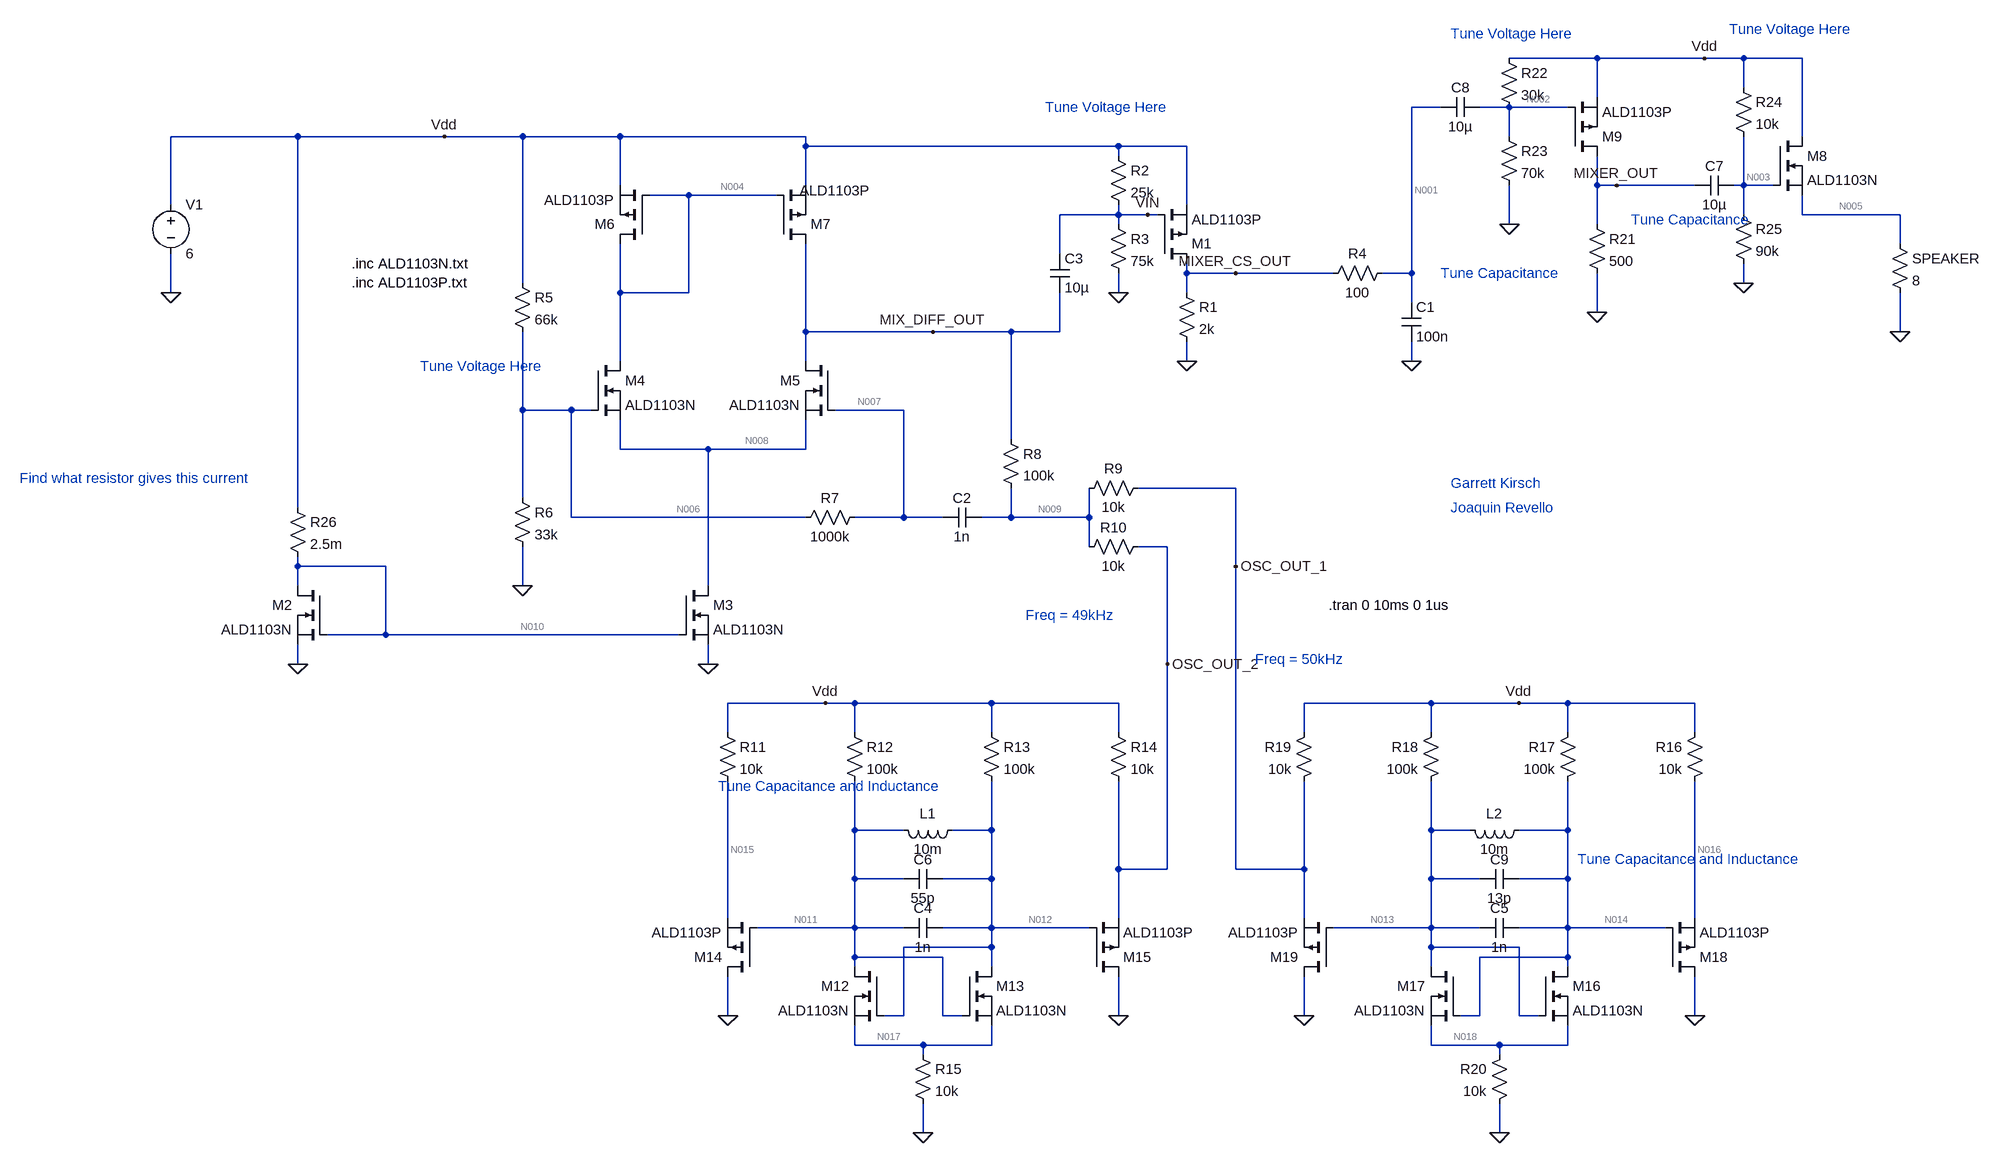
[diagram p0: schematic Final Project.asc]
Final Project.asc, the LTspice schematic file:
Version 4.1
SHEET 1 2488 1316
WIRE 1584 -464 1440 -464
WIRE 1760 -464 1584 -464
WIRE 1824 -464 1760 -464
WIRE 1920 -464 1824 -464
WIRE 1824 -416 1824 -464
WIRE 1584 -400 1584 -464
WIRE 1328 -384 1280 -384
WIRE 1440 -384 1392 -384
WIRE 1536 -384 1440 -384
WIRE -544 -336 -752 -336
WIRE -304 -336 -544 -336
WIRE -176 -336 -304 -336
WIRE -16 -336 -176 -336
WIRE 288 -336 -16 -336
WIRE 1440 -336 1440 -384
WIRE 1920 -336 1920 -464
WIRE 288 -320 288 -336
WIRE 800 -320 288 -320
WIRE 912 -320 800 -320
WIRE 800 -304 800 -320
WIRE -16 -256 -16 -336
WIRE 288 -256 288 -320
WIRE 1584 -256 1584 -304
WIRE 1616 -256 1584 -256
WIRE 1744 -256 1616 -256
WIRE 1824 -256 1824 -336
WIRE 1824 -256 1808 -256
WIRE 1872 -256 1824 -256
WIRE 96 -240 32 -240
WIRE 240 -240 96 -240
WIRE -752 -224 -752 -336
WIRE 912 -224 912 -320
WIRE 800 -208 800 -224
WIRE 800 -208 704 -208
WIRE 848 -208 800 -208
WIRE 864 -208 848 -208
WIRE 1824 -208 1824 -256
WIRE 1920 -208 1920 -240
WIRE 2080 -208 1920 -208
WIRE 800 -192 800 -208
WIRE 1440 -192 1440 -256
WIRE 1584 -192 1584 -256
WIRE 2080 -160 2080 -208
WIRE 704 -144 704 -208
WIRE 912 -112 912 -128
WIRE 992 -112 912 -112
WIRE 1152 -112 992 -112
WIRE 1280 -112 1280 -384
WIRE 1280 -112 1232 -112
WIRE -176 -96 -176 -336
WIRE 1824 -96 1824 -128
WIRE -752 -80 -752 -144
WIRE -16 -80 -16 -160
WIRE 96 -80 96 -240
WIRE 96 -80 -16 -80
WIRE 800 -80 800 -112
WIRE 912 -80 912 -112
WIRE 1280 -64 1280 -112
WIRE 1584 -48 1584 -112
WIRE 288 -16 288 -160
WIRE 496 -16 288 -16
WIRE 624 -16 496 -16
WIRE 704 -16 704 -80
WIRE 704 -16 624 -16
WIRE 2080 -16 2080 -80
WIRE -16 32 -16 -80
WIRE 288 32 288 -16
WIRE 912 32 912 0
WIRE 1280 32 1280 0
WIRE -176 112 -176 -16
WIRE -96 112 -176 112
WIRE -64 112 -96 112
WIRE 448 112 336 112
WIRE 624 160 624 -16
WIRE -16 176 -16 128
WIRE 128 176 -16 176
WIRE 288 176 288 128
WIRE 288 176 128 176
WIRE 992 240 832 240
WIRE -176 256 -176 112
WIRE -544 272 -544 -336
WIRE -96 288 -96 112
WIRE 288 288 -96 288
WIRE 448 288 448 112
WIRE 448 288 368 288
WIRE 512 288 448 288
WIRE 624 288 624 240
WIRE 624 288 576 288
WIRE 752 288 752 240
WIRE 752 288 624 288
WIRE 752 336 752 288
WIRE 880 336 832 336
WIRE -544 368 -544 352
WIRE -400 368 -544 368
WIRE 992 368 992 240
WIRE -544 400 -544 368
WIRE -176 400 -176 336
WIRE 128 400 128 176
WIRE -400 480 -400 368
WIRE -400 480 -496 480
WIRE 80 480 -400 480
WIRE -544 528 -544 496
WIRE 128 528 128 496
WIRE 880 528 880 336
WIRE 320 592 160 592
WIRE 368 592 320 592
WIRE 592 592 368 592
WIRE 800 592 592 592
WIRE 1312 592 1104 592
WIRE 1456 592 1312 592
WIRE 1536 592 1456 592
WIRE 1744 592 1536 592
WIRE 160 640 160 592
WIRE 368 640 368 592
WIRE 592 640 592 592
WIRE 800 640 800 592
WIRE 1104 640 1104 592
WIRE 1312 640 1312 592
WIRE 1536 640 1536 592
WIRE 1744 640 1744 592
WIRE 368 800 368 720
WIRE 448 800 368 800
WIRE 592 800 592 720
WIRE 592 800 528 800
WIRE 1312 800 1312 720
WIRE 1376 800 1312 800
WIRE 1536 800 1536 720
WIRE 1536 800 1456 800
WIRE 800 864 800 720
WIRE 880 864 880 528
WIRE 880 864 800 864
WIRE 992 864 992 368
WIRE 1104 864 1104 720
WIRE 1104 864 992 864
WIRE 368 880 368 800
WIRE 448 880 368 880
WIRE 592 880 592 800
WIRE 592 880 512 880
WIRE 1312 880 1312 800
WIRE 1392 880 1312 880
WIRE 1536 880 1536 800
WIRE 1536 880 1456 880
WIRE 160 944 160 720
WIRE 800 944 800 864
WIRE 1104 944 1104 864
WIRE 1744 944 1744 720
WIRE 368 960 368 880
WIRE 368 960 208 960
WIRE 448 960 368 960
WIRE 592 960 592 880
WIRE 592 960 512 960
WIRE 752 960 592 960
WIRE 1312 960 1312 880
WIRE 1312 960 1152 960
WIRE 1392 960 1312 960
WIRE 1536 960 1536 880
WIRE 1536 960 1456 960
WIRE 1696 960 1536 960
WIRE 592 992 592 960
WIRE 592 992 448 992
WIRE 1312 992 1312 960
WIRE 1456 992 1312 992
WIRE 368 1008 368 960
WIRE 512 1008 368 1008
WIRE 1536 1008 1536 960
WIRE 1536 1008 1392 1008
WIRE 368 1024 368 1008
WIRE 592 1024 592 992
WIRE 1312 1024 1312 992
WIRE 1536 1024 1536 1008
WIRE 160 1104 160 1040
WIRE 448 1104 448 992
WIRE 448 1104 416 1104
WIRE 512 1104 512 1008
WIRE 544 1104 512 1104
WIRE 800 1104 800 1040
WIRE 1104 1104 1104 1040
WIRE 1392 1104 1392 1008
WIRE 1392 1104 1360 1104
WIRE 1456 1104 1456 992
WIRE 1488 1104 1456 1104
WIRE 1744 1104 1744 1040
WIRE 368 1152 368 1120
WIRE 480 1152 368 1152
WIRE 592 1152 592 1120
WIRE 592 1152 480 1152
WIRE 1312 1152 1312 1120
WIRE 1424 1152 1312 1152
WIRE 1536 1152 1536 1120
WIRE 1536 1152 1424 1152
WIRE 480 1168 480 1152
WIRE 1424 1168 1424 1152
WIRE 480 1296 480 1248
WIRE 1424 1296 1424 1248
FLAG 912 32 0
FLAG 800 -80 0
FLAG 848 -208 VIN
FLAG -544 528 0
FLAG 128 528 0
FLAG -752 -80 0
FLAG -176 400 0
FLAG 496 -16 MIX_DIFF_OUT
FLAG 160 1104 0
FLAG 800 1104 0
FLAG 480 1296 0
FLAG 1744 1104 0
FLAG 1104 1104 0
FLAG 1424 1296 0
FLAG -304 -336 Vdd
FLAG 1760 -464 Vdd
FLAG 320 592 Vdd
FLAG 1456 592 Vdd
FLAG 880 528 OSC_OUT_2
FLAG 1584 -48 0
FLAG 1616 -256 MIXER_OUT
FLAG 1440 -192 0
FLAG 1824 -96 0
FLAG 2080 -16 0
FLAG 992 -112 MIXER_CS_OUT
FLAG 1280 32 0
FLAG 992 368 OSC_OUT_1
SYMBOL pmos 864 -128 M180
SYMATTR InstName M1
SYMATTR Value ALD1103P
SYMBOL res 896 -96 R0
SYMATTR InstName R1
SYMATTR Value 2k
SYMBOL res 784 -320 R0
SYMATTR InstName R2
SYMATTR Value 25k
SYMBOL res 784 -208 R0
SYMATTR InstName R3
SYMATTR Value 75k
SYMBOL cap 1264 -64 R0
SYMATTR InstName C1
SYMATTR Value 100n
SYMBOL nmos -496 400 M0
SYMATTR InstName M2
SYMATTR Value ALD1103N
SYMBOL nmos 80 400 R0
SYMATTR InstName M3
SYMATTR Value ALD1103N
SYMBOL nmos -64 32 R0
SYMATTR InstName M4
SYMATTR Value ALD1103N
SYMBOL nmos 336 32 M0
SYMATTR InstName M5
SYMATTR Value ALD1103N
SYMBOL pmos 32 -160 R180
SYMATTR InstName M6
SYMATTR Value ALD1103P
SYMBOL pmos 240 -160 M180
WINDOW 3 38 87 Left 2
SYMATTR Value ALD1103P
SYMATTR InstName M7
SYMBOL voltage -752 -240 R0
WINDOW 123 0 0 Left 0
WINDOW 39 0 0 Left 0
SYMATTR InstName V1
SYMATTR Value 6
SYMBOL res -192 -112 R0
SYMATTR InstName R5
SYMATTR Value 66k
SYMBOL res -192 240 R0
SYMATTR InstName R6
SYMATTR Value 33k
SYMBOL res 384 272 R90
WINDOW 0 0 56 VBottom 2
WINDOW 3 32 56 VTop 2
SYMATTR InstName R7
SYMATTR Value 1000k
SYMBOL cap 576 272 R90
WINDOW 0 0 32 VBottom 2
WINDOW 3 32 32 VTop 2
SYMATTR InstName C2
SYMATTR Value 1n
SYMBOL res 608 144 R0
SYMATTR InstName R8
SYMATTR Value 100k
SYMBOL res 848 224 R90
WINDOW 0 0 56 VBottom 2
WINDOW 3 32 56 VTop 2
SYMATTR InstName R9
SYMATTR Value 10k
SYMBOL res 848 320 R90
WINDOW 0 0 56 VBottom 2
WINDOW 3 32 56 VTop 2
SYMATTR InstName R10
SYMATTR Value 10k
SYMBOL cap 688 -144 R0
SYMATTR InstName C3
SYMATTR Value 10µ
SYMBOL nmos 1872 -336 R0
SYMATTR InstName M8
SYMATTR Value ALD1103N
SYMBOL res 144 624 R0
SYMATTR InstName R11
SYMATTR Value 10k
SYMBOL res 352 624 R0
SYMATTR InstName R12
SYMATTR Value 100k
SYMBOL res 576 624 R0
SYMATTR InstName R13
SYMATTR Value 100k
SYMBOL res 784 624 R0
SYMATTR InstName R14
SYMATTR Value 10k
SYMBOL ind 544 784 R90
WINDOW 0 5 56 VBottom 2
WINDOW 3 32 56 VTop 2
SYMATTR InstName L1
SYMATTR Value 10m
SYMBOL cap 512 944 R90
WINDOW 0 0 32 VBottom 2
WINDOW 3 32 32 VTop 2
SYMATTR InstName C4
SYMATTR Value 1n
SYMBOL nmos 416 1024 M0
SYMATTR InstName M12
SYMATTR Value ALD1103N
SYMBOL nmos 544 1024 R0
SYMATTR InstName M13
SYMATTR Value ALD1103N
SYMBOL pmos 208 1040 R180
SYMATTR InstName M14
SYMATTR Value ALD1103P
SYMBOL pmos 752 1040 M180
SYMATTR InstName M15
SYMATTR Value ALD1103P
SYMBOL res 464 1152 R0
SYMATTR InstName R15
SYMATTR Value 10k
SYMBOL res 1760 624 M0
SYMATTR InstName R16
SYMATTR Value 10k
SYMBOL res 1552 624 M0
SYMATTR InstName R17
SYMATTR Value 100k
SYMBOL res 1328 624 M0
SYMATTR InstName R18
SYMATTR Value 100k
SYMBOL res 1120 624 M0
SYMATTR InstName R19
SYMATTR Value 10k
SYMBOL ind 1360 784 M90
WINDOW 0 5 56 VBottom 2
WINDOW 3 32 56 VTop 2
SYMATTR InstName L2
SYMATTR Value 10m
SYMBOL cap 1392 944 M90
WINDOW 0 0 32 VBottom 2
WINDOW 3 32 32 VTop 2
SYMATTR InstName C5
SYMATTR Value 1n
SYMBOL nmos 1488 1024 R0
SYMATTR InstName M16
SYMATTR Value ALD1103N
SYMBOL nmos 1360 1024 M0
SYMATTR InstName M17
SYMATTR Value ALD1103N
SYMBOL pmos 1696 1040 M180
SYMATTR InstName M18
SYMATTR Value ALD1103P
SYMBOL pmos 1152 1040 R180
SYMATTR InstName M19
SYMATTR Value ALD1103P
SYMBOL res 1440 1152 M0
SYMATTR InstName R20
SYMATTR Value 10k
SYMBOL pmos 1536 -304 M180
SYMATTR InstName M9
SYMATTR Value ALD1103P
SYMBOL res 1568 -208 R0
SYMATTR InstName R21
SYMATTR Value 500
SYMBOL res 1424 -480 R0
SYMATTR InstName R22
SYMATTR Value 30k
SYMBOL res 1424 -352 R0
SYMATTR InstName R23
SYMATTR Value 70k
SYMBOL cap 1808 -272 R90
WINDOW 0 0 32 VBottom 2
WINDOW 3 32 32 VTop 2
SYMATTR InstName C7
SYMATTR Value 10µ
SYMBOL cap 1392 -400 R90
WINDOW 0 0 32 VBottom 2
WINDOW 3 32 32 VTop 2
SYMATTR InstName C8
SYMATTR Value 10µ
SYMBOL res 1808 -432 R0
SYMATTR InstName R24
SYMATTR Value 10k
SYMBOL res 1808 -224 R0
SYMATTR InstName R25
SYMATTR Value 90k
SYMBOL res 2064 -176 R0
SYMATTR InstName SPEAKER
SYMATTR Value 8
SYMBOL res 1248 -128 R90
WINDOW 0 0 56 VBottom 2
WINDOW 3 32 56 VTop 2
SYMATTR InstName R4
SYMATTR Value 100
SYMBOL cap 512 864 R90
WINDOW 0 0 32 VBottom 2
WINDOW 3 32 32 VTop 2
SYMATTR InstName C6
SYMATTR Value 55p
SYMBOL cap 1456 864 R90
WINDOW 0 0 32 VBottom 2
WINDOW 3 32 32 VTop 2
SYMATTR InstName C9
SYMATTR Value 13p
SYMBOL res -560 256 R0
SYMATTR InstName R26
SYMATTR Value 2.5m
TEXT -456 -128 Left 2 !.inc ALD1103N.txt\n.inc ALD1103P.txt
TEXT -1000 224 Left 2 ;Find what resistor gives this current
TEXT 1344 -504 Left 2 ;Tune Voltage Here
TEXT 680 -384 Left 2 ;Tune Voltage Here
TEXT -344 40 Left 2 ;Tune Voltage Here
TEXT 1328 -112 Left 2 ;Tune Capacitance
TEXT 144 728 Left 2 ;Tune Capacitance and Inductance
TEXT 1552 848 Left 2 ;Tune Capacitance and Inductance
TEXT 1344 232 Left 2 ;Garrett Kirsch
TEXT 1344 272 Left 2 ;Joaquin Revello
TEXT 1800 -512 Left 2 ;Tune Voltage Here
TEXT 1640 -200 Left 2 ;Tune Capacitance
TEXT 1144 432 Left 2 !.tran 0 10ms 0 1us
TEXT 648 448 Left 2 ;Freq = 49kHz
TEXT 1024 520 Left 2 ;Freq = 50kHz

The netlist it stands for:
* Final Project.asc
M1 MIXER_CS_OUT VIN Vdd Vdd ALD1103P
R1 MIXER_CS_OUT 0 2k
R2 Vdd VIN 25k
R3 VIN 0 75k
C1 N001 0 100n
M2 N010 N010 0 0 ALD1103N
M3 N008 N010 0 0 ALD1103N
M4 N004 N006 N008 N008 ALD1103N
M5 MIX_DIFF_OUT N007 N008 N008 ALD1103N
M6 N004 N004 Vdd Vdd ALD1103P
M7 MIX_DIFF_OUT N004 Vdd Vdd ALD1103P
V1 Vdd 0 6
R5 Vdd N006 66k
R6 N006 0 33k
R7 N007 N006 1000k
C2 N009 N007 1n
R8 MIX_DIFF_OUT N009 100k
R9 OSC_OUT_1 N009 10k
R10 OSC_OUT_2 N009 10k
C3 VIN MIX_DIFF_OUT 10µ
M8 Vdd N003 N005 N005 ALD1103N
R11 Vdd N015 10k
R12 Vdd N011 100k
R13 Vdd N012 100k
R14 Vdd OSC_OUT_2 10k
L1 N012 N011 10m
C4 N012 N011 1n
M12 N011 N012 N017 N017 ALD1103N
M13 N012 N011 N017 N017 ALD1103N
M14 0 N011 N015 N015 ALD1103P
M15 0 N012 OSC_OUT_2 OSC_OUT_2 ALD1103P
R15 N017 0 10k
R16 Vdd N016 10k
R17 Vdd N014 100k
R18 Vdd N013 100k
R19 Vdd OSC_OUT_1 10k
L2 N013 N014 10m
C5 N013 N014 1n
M16 N014 N013 N018 N018 ALD1103N
M17 N013 N014 N018 N018 ALD1103N
M18 0 N014 N016 N016 ALD1103P
M19 0 N013 OSC_OUT_1 OSC_OUT_1 ALD1103P
R20 N018 0 10k
M9 MIXER_OUT N002 Vdd Vdd ALD1103P
R21 MIXER_OUT 0 500
R22 Vdd N002 30k
R23 N002 0 70k
C7 N003 MIXER_OUT 10µ
C8 N002 N001 10µ
R24 Vdd N003 10k
R25 N003 0 90k
R§SPEAKER N005 0 8
R4 N001 MIXER_CS_OUT 100
C6 N012 N011 55p
C9 N014 N013 13p
R26 Vdd N010 2.5m
.model NMOS NMOS
.model PMOS PMOS
.lib standard.mos
.inc ALD1103N.txt
.inc ALD1103P.txt
* Find what resistor gives this current
* Tune Voltage Here
* Tune Voltage Here
* Tune Voltage Here
* Tune Capacitance
* Tune Capacitance and Inductance
* Tune Capacitance and Inductance
* Garrett Kirsch
* Joaquin Revello
* Tune Voltage Here
* Tune Capacitance
.tran 0 10ms 0 1us
* Freq = 49kHz
* Freq = 50kHz
.backanno
.end

* Results of the author's LTspice run, read from the files saved beside the schematic
* Operating Point, zero values left out:
*   V(vin) = 4.5 V
*   V(n001) = 2.357 V
*   V(n010) = 6 V
*   V(n004) = 3.694 V
*   V(n007) = 2 V
*   V(osc_out_1) = 2.744 V
*   V(osc_out_2) = 2.744 V
*   V(n005) = 340.4 mV
*   V(n012) = 1.651 V
*   V(n016) = 2.741 V
*   V(n018) = 869.9 mV
*   V(n002) = 4.2 V
*   V(mixer_cs_out) = 2.357 V
*   V(vdd) = 6 V
*   V(n008) = 288.4 mV
*   V(n006) = 2 V
*   V(mix_diff_out) = 3.581 V
*   V(n009) = 2.784 V
*   V(n003) = 5.4 V
*   V(n015) = 2.741 V
*   V(n011) = 1.651 V
*   V(n017) = 869.9 mV
*   V(n014) = 1.651 V
*   V(n013) = 1.651 V
*   V(mixer_out) = 1.042 V
*   I(R18) = 43.49 µA
*   I(R6) = 60.61 µA
*   Id(M1) = -1.179 mA
*   Is(M1) = 1.179 mA
*   Ib(M1) = 3.653 pA
*   I(R10) = -3.986 µA
*   Id(M17) = 43.49 µA
*   Is(M17) = -43.49 µA
*   Id(M2) = 56.68 mA
*   Is(M2) = -56.68 mA
*   Ib(M2) = -6.018 pA
*   I(R2) = 60 µA
*   Id(M7) = -3.898 mA
*   Is(M7) = 3.898 mA
*   Ib(M7) = 2.43 pA
*   I(R15) = 86.99 µA
*   I(R13) = 43.49 µA
*   I(R21) = 2.084 mA
*   Id(M13) = 43.49 µA
*   Is(M13) = -43.49 µA
*   Id(M4) = 3.895 mA
*   Is(M4) = -3.895 mA
*   Ib(M4) = -3.417 pA
*   I(R24) = 60 µA
*   Id(M8) = 42.55 mA
*   Is(M8) = -42.55 mA
*   Ib(M8) = -5.677 pA
*   Id(M19) = -329.6 µA
*   Is(M19) = 329.6 µA
*   Ib(M19) = 2.754 pA
*   I(R5) = 60.61 µA
*   I(R23) = 60 µA
*   I(R17) = 43.49 µA
*   Id(M16) = 43.49 µA
*   Is(M16) = -43.49 µA
*   I(R12) = 43.49 µA
*   Id(M6) = -3.895 mA
*   Is(M6) = 3.895 mA
*   Ib(M6) = 2.317 pA
*   Id(M15) = -329.6 µA
*   Is(M15) = 329.6 µA
*   Ib(M15) = 2.754 pA
*   I(R9) = -3.986 µA
*   I(R1) = 1.179 mA
*   Id(M9) = -2.084 mA
*   Is(M9) = 2.084 mA
*   Ib(M9) = 4.969 pA
*   I(SPEAKER) = 42.55 mA
*   Id(M18) = -325.9 µA
*   Is(M18) = 325.9 µA
*   Ib(M18) = 2.751 pA
*   Id(M3) = 7.786 mA
*   Is(M3) = -7.786 mA
*   I(R19) = 325.6 µA
*   Id(M12) = 43.49 µA
*   Is(M12) = -43.49 µA
*   I(R3) = 60 µA
*   I(R14) = 325.6 µA
*   I(V1) = -112 mA
*   I(R22) = 60 µA
*   I(R16) = 325.9 µA
*   I(R11) = 325.9 µA
*   I(R20) = 86.99 µA
*   I(R26) = 56.68 mA
*   Id(M5) = 3.89 mA
*   Is(M5) = -3.89 mA
*   Ib(M5) = -3.303 pA
*   I(R25) = 60 µA
*   I(R8) = 7.971 µA
*   Id(M14) = -325.9 µA
*   Is(M14) = 325.9 µA
*   Ib(M14) = 2.751 pA